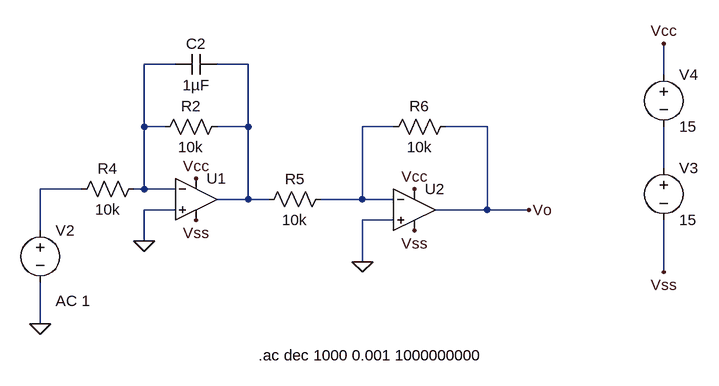
[diagram p0: schematic ActividadEnClase.asc]
ActividadEnClase.asc, the LTspice schematic file:
Version 4.1
SHEET 1 1752 680
WIRE -96 48 -144 48
WIRE 16 48 -32 48
WIRE 656 64 656 16
WIRE -144 144 -144 48
WIRE -112 144 -144 144
WIRE 16 144 16 48
WIRE 16 144 -32 144
WIRE 240 144 192 144
WIRE 384 144 320 144
WIRE 656 208 656 144
WIRE -240 240 -304 240
WIRE -144 240 -144 144
WIRE -144 240 -160 240
WIRE -96 240 -144 240
WIRE 16 256 16 144
WIRE 16 256 -32 256
WIRE 48 256 16 256
WIRE 192 256 192 144
WIRE 192 256 128 256
WIRE 240 256 192 256
WIRE -96 272 -144 272
WIRE 384 272 384 144
WIRE 384 272 304 272
WIRE 448 272 384 272
WIRE 240 288 192 288
WIRE -304 304 -304 240
WIRE -144 320 -144 272
WIRE 192 352 192 288
WIRE 656 368 656 288
WIRE -304 448 -304 384
FLAG 192 352 0
FLAG -144 320 0
FLAG -304 448 0
FLAG 656 16 Vcc
FLAG 272 240 Vcc
FLAG -64 224 Vcc
FLAG -64 288 Vss
FLAG 272 304 Vss
FLAG 656 368 Vss
FLAG 448 272 Vo
SYMBOL res -16 128 R90
WINDOW 0 0 56 VBottom 2
WINDOW 3 32 56 VTop 2
SYMATTR InstName R2
SYMATTR Value 10k
SYMBOL res -144 224 R90
WINDOW 0 0 56 VBottom 2
WINDOW 3 32 56 VTop 2
SYMATTR InstName R4
SYMATTR Value 10k
SYMBOL res 144 240 R90
WINDOW 0 0 56 VBottom 2
WINDOW 3 32 56 VTop 2
SYMATTR InstName R5
SYMATTR Value 10k
SYMBOL res 336 128 R90
WINDOW 0 0 56 VBottom 2
WINDOW 3 32 56 VTop 2
SYMATTR InstName R6
SYMATTR Value 10k
SYMBOL cap -32 32 R90
WINDOW 0 0 32 VBottom 2
WINDOW 3 32 32 VTop 2
SYMATTR InstName C2
SYMATTR Value 1µF
SYMBOL voltage -304 288 R0
WINDOW 123 24 124 Left 2
WINDOW 39 0 0 Left 0
SYMATTR Value2 AC 1
SYMATTR InstName V2
SYMATTR Value ""
SYMBOL voltage 656 192 R0
WINDOW 123 0 0 Left 0
WINDOW 39 0 0 Left 0
SYMATTR InstName V3
SYMATTR Value 15
SYMBOL voltage 656 48 R0
WINDOW 123 0 0 Left 0
WINDOW 39 0 0 Left 0
SYMATTR InstName V4
SYMATTR Value 15
SYMBOL OpAmps\\UniversalOpAmp -64 256 R0
SYMATTR InstName U1
SYMATTR Value2 Avol=1Meg GBW=100G Vos=0
SYMBOL OpAmps\\UniversalOpAmp 272 272 R0
SYMATTR InstName U2
SYMATTR Value2 Avol=1Meg GBW=100G Vos=0
TEXT 32 496 Left 2 !.ac dec 1000 0.001 1000000000

The netlist it stands for:
* ActividadEnClase.asc
R2 N002 N001 10k
R4 N001 N005 10k
R5 N003 N002 10k
R6 Vo N003 10k
C2 N002 N001 1µF
V2 N005 0 AC 1
V3 N004 Vss 15
V4 Vcc N004 15
X§U1 0 N001 Vcc Vss N002 level1 Avol=1Meg GBW=100G Vos=0 En=0 Enk=0 In=0 Ink=0 Rin=500Meg  ; pins In+ In- V+ V- OUT
X§U2 0 N003 Vcc Vss Vo level1 Avol=1Meg GBW=100G Vos=0 En=0 Enk=0 In=0 Ink=0 Rin=500Meg  ; pins In+ In- V+ V- OUT
.ac dec 1000 0.001 1000000000
.lib UniversalOpAmp1.lib
.backanno
.end